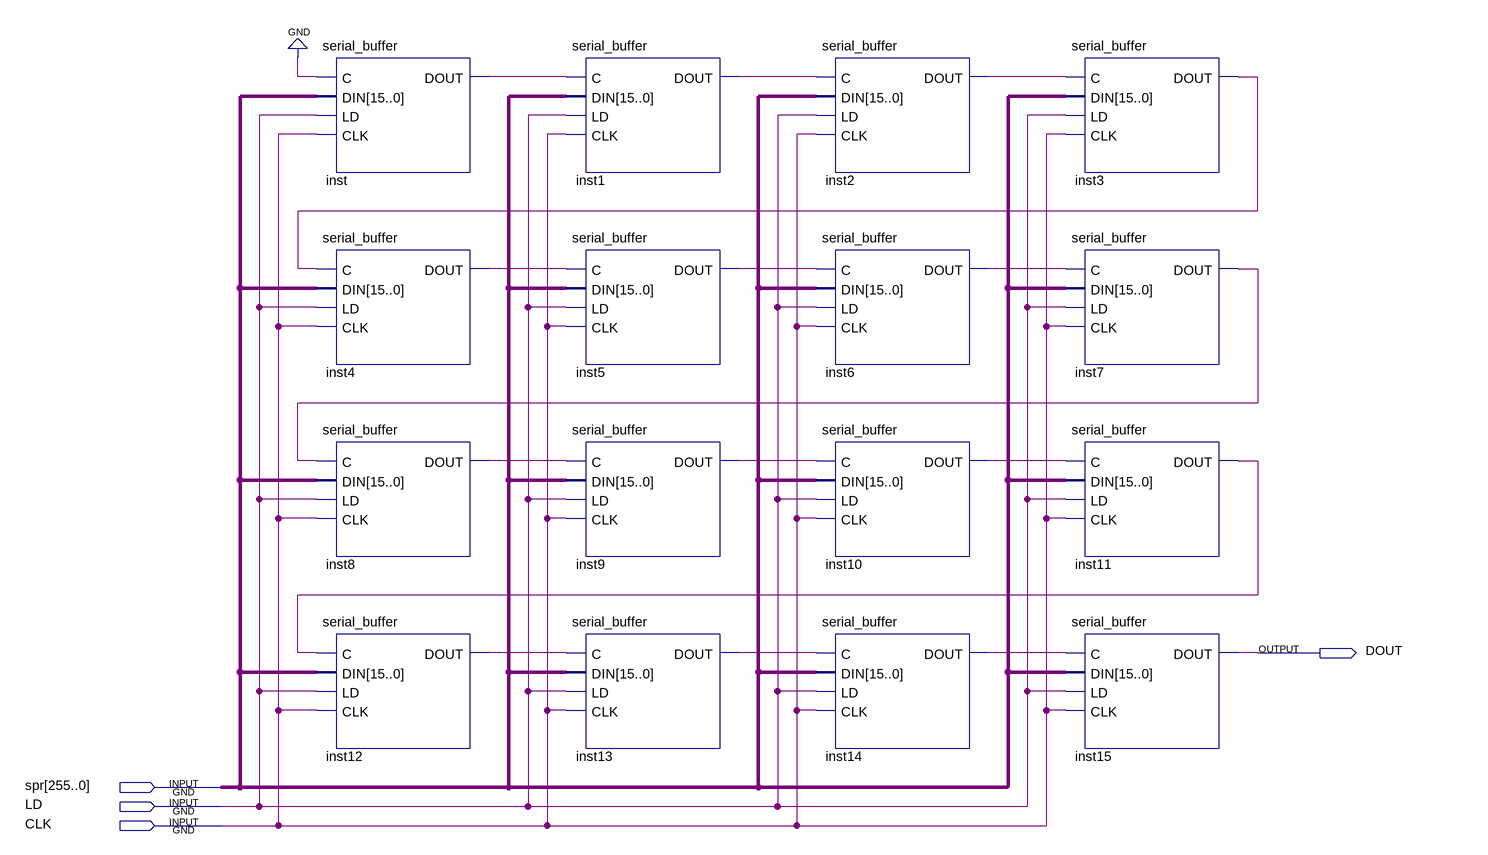
[diagram p0: schematic sheet]
// Quartus schematic sprite_buffer_old.bdf as structural Verilog: 16 symbols, 4 pins
module sprite_buffer_old (
  input  [255:0] spr,
  input  LD,
  input  CLK,
  output DOUT
);

  wire inst1_dout, inst2_dout, inst3_dout, inst4_dout, inst5_dout, inst6_dout, inst7_dout, inst8_dout,
       inst9_dout, inst10_dout, inst11_dout, inst12_dout, inst13_dout, inst14_dout, inst_dout;

  serial_buffer inst (.DIN(spr[255:240]), .LD(LD), .C(1'b0), .CLK(CLK), .DOUT(inst_dout));
  serial_buffer inst4 (.DIN(spr[191:176]), .LD(LD), .C(inst3_dout), .CLK(CLK), .DOUT(inst4_dout));
  serial_buffer inst8 (.DIN(spr[127:112]), .LD(LD), .C(inst7_dout), .CLK(CLK), .DOUT(inst8_dout));
  serial_buffer inst12 (.DIN(spr[63:48]), .LD(LD), .C(inst11_dout), .CLK(CLK), .DOUT(inst12_dout));
  serial_buffer inst1 (.DIN(spr[239:224]), .LD(LD), .C(inst_dout), .CLK(CLK), .DOUT(inst1_dout));
  serial_buffer inst5 (.DIN(spr[175:160]), .LD(LD), .C(inst4_dout), .CLK(CLK), .DOUT(inst5_dout));
  serial_buffer inst9 (.DIN(spr[111:96]), .LD(LD), .C(inst8_dout), .CLK(CLK), .DOUT(inst9_dout));
  serial_buffer inst13 (.DIN(spr[47:32]), .LD(LD), .C(inst12_dout), .CLK(CLK), .DOUT(inst13_dout));
  serial_buffer inst2 (.DIN(spr[223:208]), .LD(LD), .C(inst1_dout), .CLK(CLK), .DOUT(inst2_dout));
  serial_buffer inst6 (.DIN(spr[159:144]), .LD(LD), .C(inst5_dout), .CLK(CLK), .DOUT(inst6_dout));
  serial_buffer inst10 (.DIN(spr[95:80]), .LD(LD), .C(inst9_dout), .CLK(CLK), .DOUT(inst10_dout));
  serial_buffer inst14 (.DIN(spr[31:16]), .LD(LD), .C(inst13_dout), .CLK(CLK), .DOUT(inst14_dout));
  serial_buffer inst3 (.DIN(spr[207:192]), .LD(LD), .C(inst2_dout), .CLK(CLK), .DOUT(inst3_dout));
  serial_buffer inst7 (.DIN(spr[143:128]), .LD(LD), .C(inst6_dout), .CLK(CLK), .DOUT(inst7_dout));
  serial_buffer inst11 (.DIN(spr[79:64]), .LD(LD), .C(inst10_dout), .CLK(CLK), .DOUT(inst11_dout));
  serial_buffer inst15 (.DIN(spr[15:0]), .LD(LD), .C(inst14_dout), .CLK(CLK), .DOUT(DOUT));
endmodule
